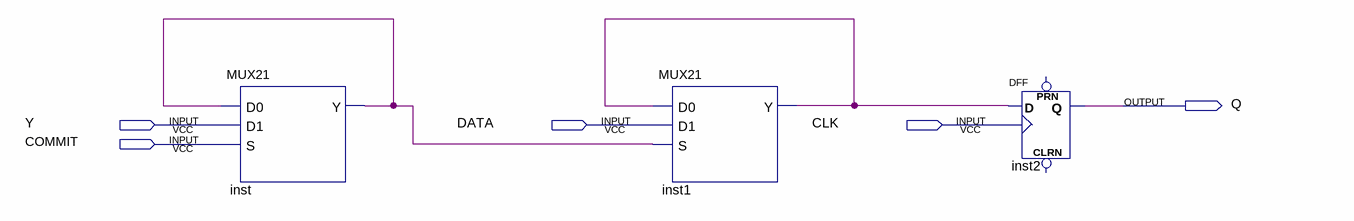
[diagram p0: schematic sheet]
// Quartus schematic Register.bdf as structural Verilog: 3 symbols, 5 pins
module Register (
  input  Y,
  input  DATA,
  input  CLK,
  input  COMMIT,
  output Q
);

  wire inst1_y, inst_y;

  MUX21 inst (.D0(inst_y), .D1(Y), .S(COMMIT), .Y(inst_y));
  MUX21 inst1 (.D0(inst1_y), .D1(DATA), .S(inst_y), .Y(inst1_y));
  DFF inst2 (.CLK(CLK), .D(inst1_y), .Q(Q));  // open: CLRN, PRN
endmodule
